# Altium schematic sheet Led.SchDoc
size A4
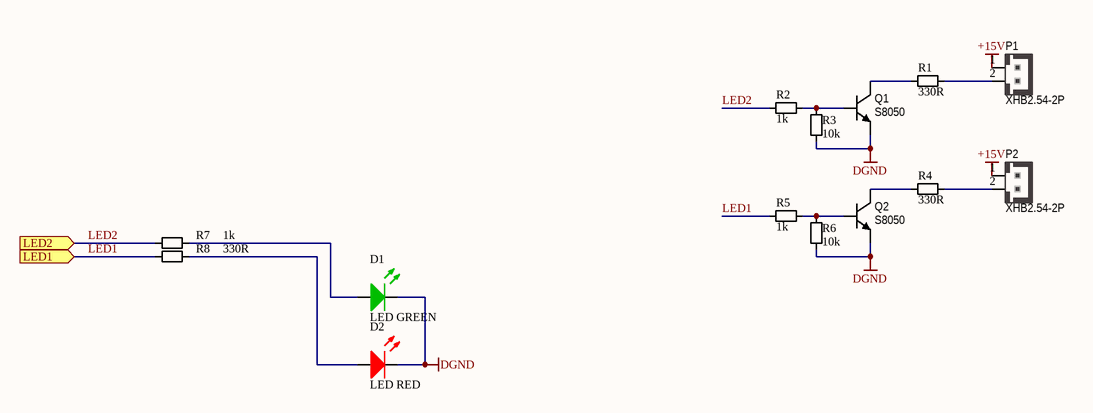
[diagram p0: Led.SchDoc]

## Parts
D1  LED GREEN  [0805-LED-G]
D2  LED RED  [0805-LED-R]
P1  XHB2.54-2P  [XH-2]
P2  XHB2.54-2P  [XH-2]
Q1  S8050  [SOT-23_N]
Q2  S8050  [SOT-23_N]
R1  value 330R  [0603-R]  (hidden comment: Res)
R2  value 1k  [0603-R]  (hidden comment: Res)
R3  value 10k  [0603-R]  (hidden comment: Res)
R4  value 330R  [0603-R]  (hidden comment: Res)
R5  value 1k  [0603-R]  (hidden comment: Res)
R6  value 10k  [0603-R]  (hidden comment: Res)
R7  value 1k  [0603-R]  (hidden comment: Res)
R8  value 330R  [0603-R]  (hidden comment: Res)

## Ports
LED1 (in), LED2 (in)

## Nets
+15V: P1.1 P2.1
DGND: D1.2 D2.2 Q1.2(E) Q2.2(E) R3.2 R6.2
LED1: R5.1 R8.1 ; port LED1
LED2: R2.1 R7.1 ; port LED2
NetD1_1: D1.1 R7.2
NetD2_1: D2.1 R8.2
NetP1_2: P1.2 R1.2
NetP2_2: P2.2 R4.2
NetQ1_1: Q1.1(B) R2.2 R3.1
NetQ1_3: Q1.3(C) R1.1
NetQ2_1: Q2.1(B) R5.2 R6.1
NetQ2_3: Q2.3(C) R4.1

## Library data of the parts
D1 = D614000000G0: LIGHT EMITTING DIODE 0805 GREEN; TemperatureRange: -30 to 85°C; VenderID: LED-0805-GREEN; Published: 1-Jun-2017; Publisher: GreenBox; PackageReference: 0805; MountType: SMT; Manufacturer: *
D2 = D614000000R0: LIGHT EMITTING DIODE 0805 RED; TemperatureRange: -30 to 85°C; VenderID: LED-0805-RED; Published: 1-Jun-2017; Publisher: GreenBox; PackageReference: 0805; MountType: SMT; Manufacturer: *
P1 P2 = P6DX02Z25400: Header XHB2.54-2P 2.54mm; TemperatureRange: -25 to 85°C; Manufacturer: *; MountType: DIP; PackageReference: XH2.54-2P; Published: 1-Jun-2017; Publisher: GreenBox; VenderID: XHB2.54-2P
Q1 Q2 = DN42S8050000: NPN S8050 Icm 0.5A Vcbo 40V; TemperatureRange: -55 to 150°C; Manufacturer: *; MountType: SMT; PackageReference: SOT-23; Published: 1-Jun-2017; Publisher: GreenBox; VenderID: S8050
R1 R4 R8 = R11C330RFBF0: SMD Resistor 330R 1% 1/10W 0603 100PPM; TemperatureRange: -55°C to 150°C; VenderID: RES-0603-330R-1%; Published: 1-Jun-2017; Publisher: GreenBox; MountType: SMT; PackageReference: 0603; Manufacturer: *
R2 R5 R7 = R11C001kFBF0: SMD Resistor 1k 1% 1/10W 0603 100PPM; TemperatureRange: -55°C to 150°C; VenderID: RES-0603-1k-1%; Published: 1-Jun-2017; Publisher: GreenBox; MountType: SMT; PackageReference: 0603; Manufacturer: *
R3 R6 = R11C010KFBF0: SMD Resistor 10k 1% 1/10W 0603 100PPM; TemperatureRange: -55°C to 150°C; VenderID: RES-0603-10k-1%; Published: 1-Jun-2017; Publisher: GreenBox; MountType: SMT; PackageReference: 0603; Manufacturer: *